# EAGLE schematic Esquemático (EAGLE 9.6.2)
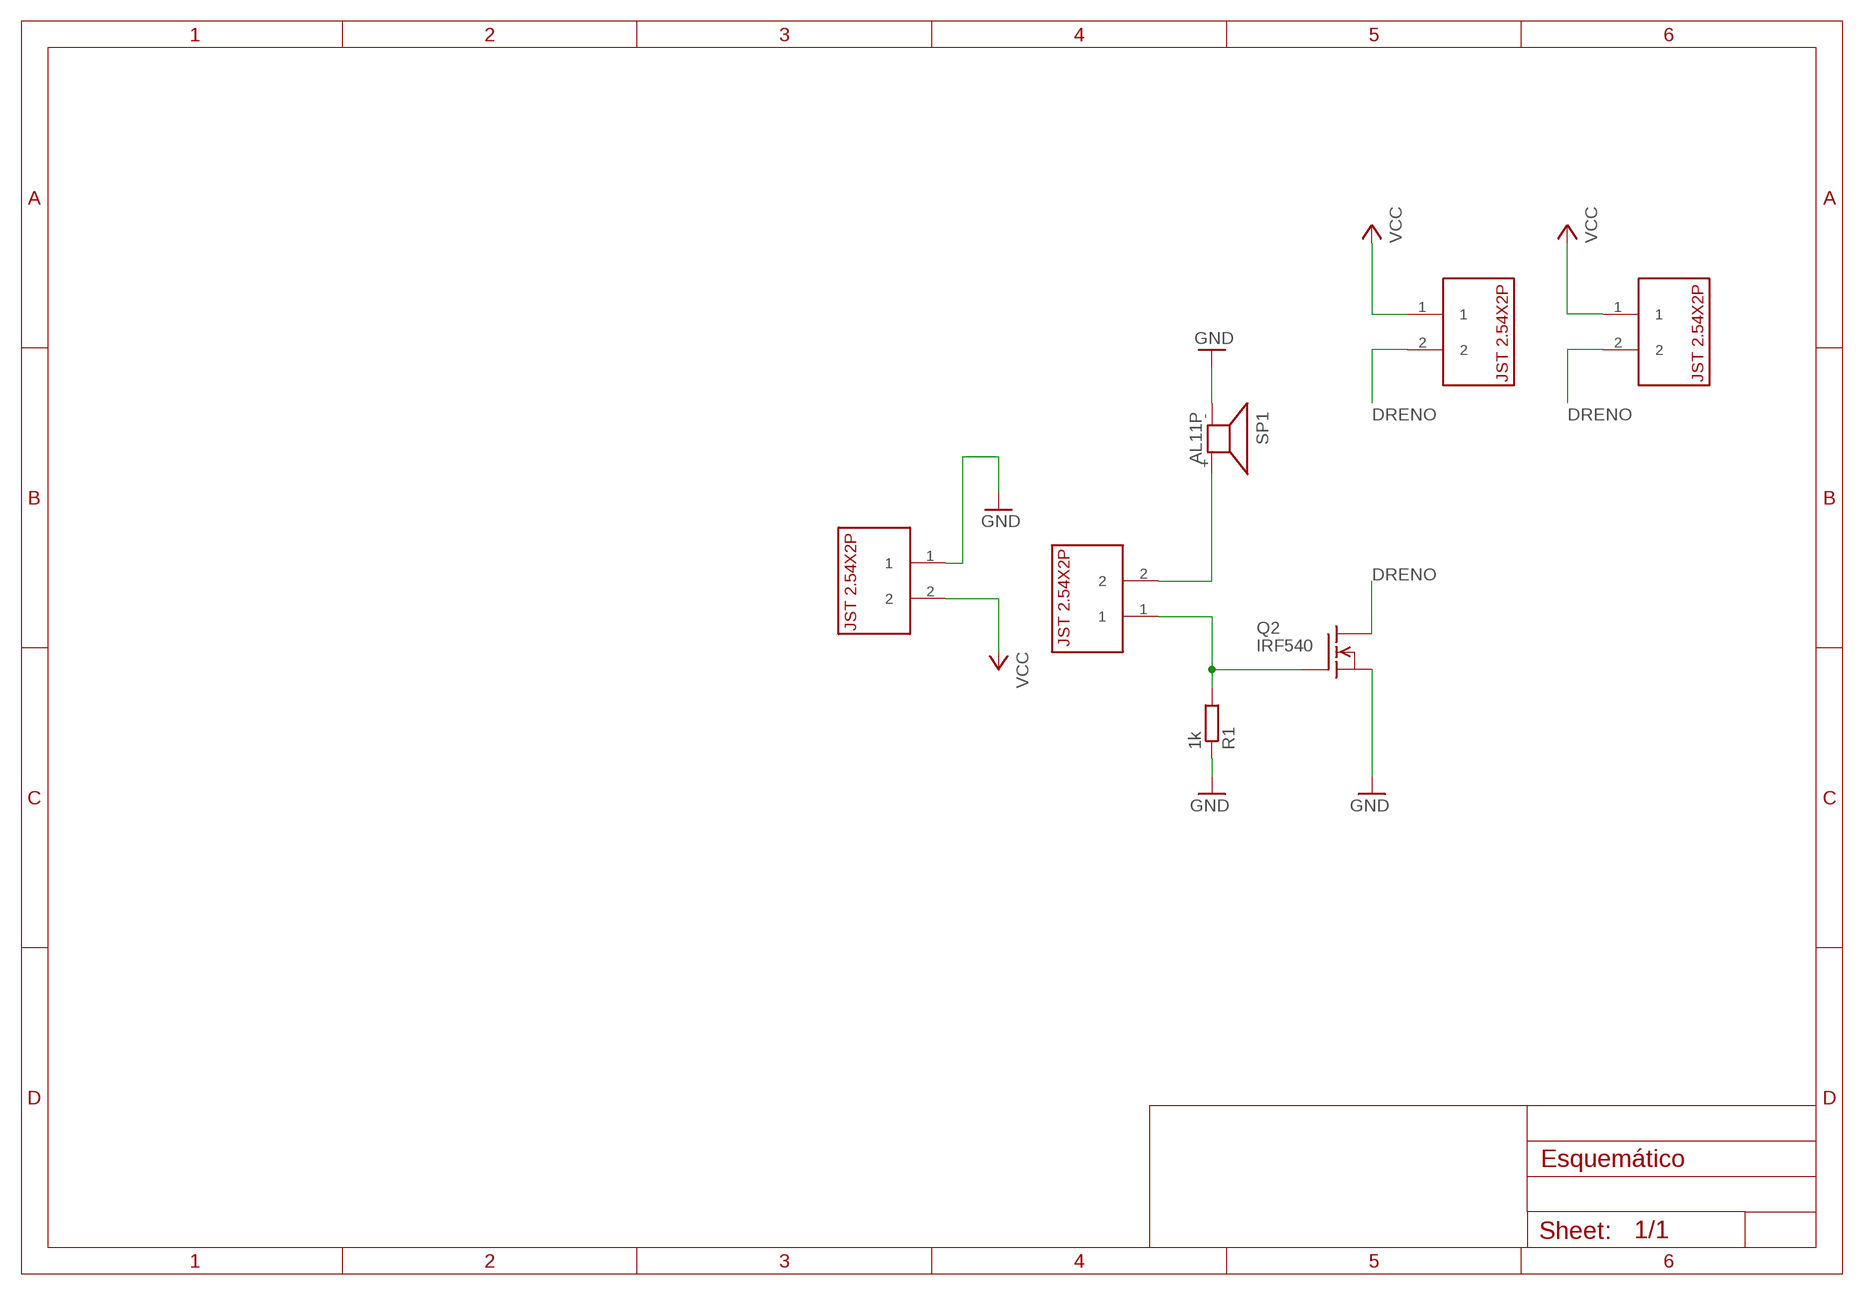
[diagram p0: schematic, sheet 1]

## Parts
Q2  IRF540  [TO220]
R1  1k  R-EU_0204/7  [0204/7]
SP1  AL11P  [AL11P]
U$1  JST2.54X2P  [JST2.54X2P_FOOTPRINT]
U$2  JST2.54X2P  [JST2.54X2P_FOOTPRINT]
U$3  JST2.54X2P  [JST2.54X2P_FOOTPRINT]
U$4  JST2.54X2P  [JST2.54X2P_FOOTPRINT]

## Nets
DRENO: Q2.2(D) U$2.2 U$3.2
GND: Q2.3(S) R1.1 SP1.- U$4.1
N$1: Q2.1(G) R1.2 U$1.1
N$3: SP1.+ U$1.2
VCC: U$2.1 U$3.1 U$4.2

## Library data of the parts
Q2 = transistor-fet:IRF540: N-Channel Enhancement MOSFET (HEXFET); 100V; 28A; 0,077Ohm
R1 = rcl:R-EU_: RESISTOR, European symbol; SPICEPREFIX: R
SP1 = buzzer:AL11P: SPEAKER Source: Buerklin; OC_FARNELL: unknown; OC_NEWARK: unknown
U$1-U$4 = CRD:JST2.54X2P: Conector JST 2 pinos (2.54mm de distância entre pinos)